# EAGLE schematic B684X (EAGLE 6.6.0)
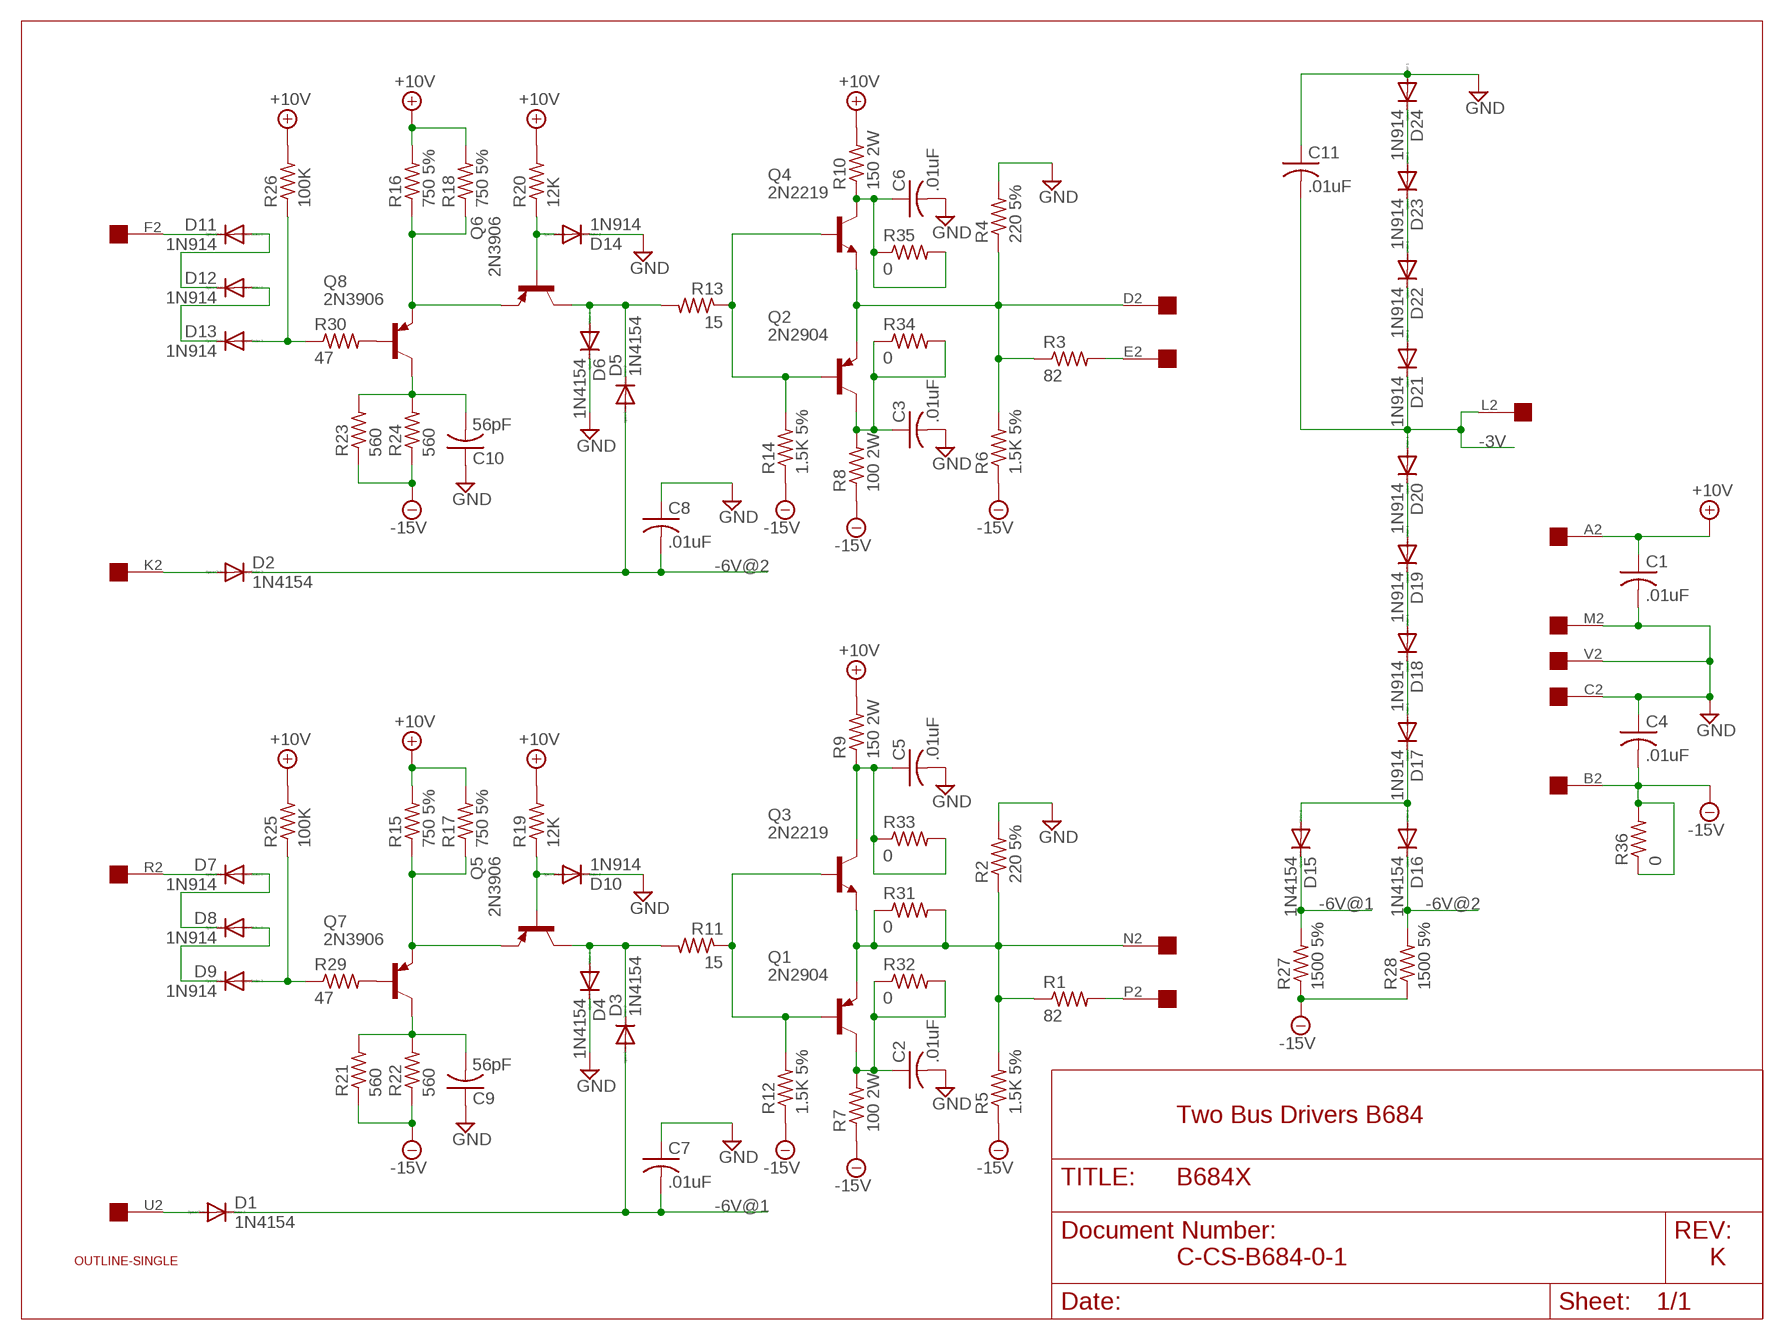
[diagram p0: schematic, sheet 1]

## Parts
C1  .01uF  C-US  [C063-025X075]
C2  .01uF  C-US  [C063-025X075]
C3  .01uF  C-US  [C063-025X075]
C4  .01uF  C-US  [C063-025X075]
C5  .01uF  C-US  [C063-025X075]
C6  .01uF  C-US  [C063-025X075]
C7  .01uF  C-US  [C063-025X075]
C8  .01uF  C-US  [C063-025X075]
C9  56pF  C-US  [C063-025X075]
C10  56pF  C-US  [C063-025X075]
C11  .01uF  C-US  [C063-025X075]
D1  1N4154  1N4148DO35-10  [DO35-10]
D2  1N4154  1N4148DO35-10  [DO35-10]
D3  1N4154  1N4148DO35-10  [DO35-10]
D4  1N4154  1N4148DO35-10  [DO35-10]
D5  1N4154  1N4148DO35-10  [DO35-10]
D6  1N4154  1N4148DO35-10  [DO35-10]
D7  1N914  1N4148DO35-10  [DO35-10]
D8  1N914  1N4148DO35-10  [DO35-10]
D9  1N914  DIODE-DO35-10  [DO35-10]
D10  1N914  1N4148DO35-10  [DO35-10]
D11  1N914  1N4148DO35-10  [DO35-10]
D12  1N914  1N4148DO35-10  [DO35-10]
D13  1N914  DIODE-DO35-10  [DO35-10]
D14  1N914  1N4148DO35-10  [DO35-10]
D15  1N4154  1N4148DO35-10  [DO35-10]
D16  1N4154  1N4148DO35-10  [DO35-10]
D17  1N914  1N4148DO35-10  [DO35-10]
D18  1N914  1N4148DO35-10  [DO35-10]
D19  1N914  1N4148DO35-10  [DO35-10]
D20  1N914  1N4148DO35-10  [DO35-10]
D21  1N914  1N4148DO35-10  [DO35-10]
D22  1N914  1N4148DO35-10  [DO35-10]
D23  1N914  1N4148DO35-10  [DO35-10]
D24  1N914  1N4148DO35-10  [DO35-10]
Q1  2N2904  2N3637  [TO39]
Q2  2N2904  2N3637  [TO39]
Q3  2N2219  [TO5]
Q4  2N2219  [TO5]
Q5  2N3906  2N3637  [TO39]
Q6  2N3906  2N3637  [TO39]
Q7  2N3906  2N3637  [TO39]
Q8  2N3906  2N3637  [TO39]
R1  82  R-US_0207/10  [0207/10]
R2  220 5%  R-US_0207/10  [0207/10]
R3  82  R-US_0207/10  [0207/10]
R4  220 5%  R-US_0207/10  [0207/10]
R5  1.5K 5%  R-US_0207/10  [0207/10]
R6  1.5K 5%  R-US_0207/10  [0207/10]
R7  100 2W  R-US_0817/22  [P0817/22]
R8  100 2W  R-US_0817/22  [P0817/22]
R9  150 2W  R-US_0817/22  [P0817/22]
R10  150 2W  R-US_0817/22  [P0817/22]
R11  15  R-US_0207/10  [0207/10]
R12  1.5K 5%  R-US_0207/10  [0207/10]
R13  15  R-US_0207/10  [0207/10]
R14  1.5K 5%  R-US_0207/10  [0207/10]
R15  750 5%  R-US_0207/10  [0207/10]
R16  750 5%  R-US_0207/10  [0207/10]
R17  750 5%  R-US_0207/10  [0207/10]
R18  750 5%  R-US_0207/10  [0207/10]
R19  12K  R-US_0207/10  [0207/10]
R20  12K  R-US_0207/10  [0207/10]
R21  560  R-US_0207/10  [0207/10]
R22  560  R-US_0207/10  [0207/10]
R23  560  R-US_0207/10  [0207/10]
R24  560  R-US_0207/10  [0207/10]
R25  100K  R-US_0207/10  [0207/10]
R26  100K  R-US_0207/10  [0207/10]
R27  1500 5%  R-US_0207/10  [0207/10]
R28  1500 5%  R-US_0207/10  [0207/10]
R29  47  R-US_0207/10  [0207/10]
R30  47  R-US_0207/10  [0207/10]
R31  0  R-US_0207/10  [0207/10]
R32  0  R-US_0207/10  [0207/10]
R33  0  R-US_0207/10  [0207/10]
R34  0  R-US_0207/10  [0207/10]
R35  0  R-US_0207/10  [0207/10]
R36  0  R-US_0207/10  [0207/10]
U$1  OUTLINE-SINGLE  [SINGLE]
U$2  EDGE-1  [EDGE-CON1]

## Nets
+10V [Power]: C1.1 R9.2 R10.2 R15.2 R16.2 R17.2 R18.2 R19.2 R20.2 R25.2 R26.2 U$2.A2
-3V [Power]: C11.2 D20.A D21.C U$2.L2
-6V@1: C7.2 D1.C D3.A D15.C R27.2
-6V@2: C8.2 D2.C D5.A D16.C R28.2
-15V [Power]: C4.2 R5.1 R6.1 R7.1 R8.1 R12.1 R14.1 R21.1 R22.1 R23.1 R24.1 R27.1 R28.1 R36.1 R36.2 U$2.B2
GND [Power]: C1.2 C2.2 C3.2 C4.1 C5.2 C6.2 C7.1 C8.1 C9.1 C10.1 C11.1 D4.C D6.C D10.C D14.C D24.A R2.2 R4.2 U$2.C2 U$2.M2 U$2.V2
N$1: D11.C U$2.F2
N$2: D11.A D12.C
N$3: D13.A R26.1 R30.1
N$4: D12.A D13.C
N$5: Q7.2(B) R29.2
N$6: C10.2 Q8.3(C) R23.2 R24.2
N$7: Q6.1(E) Q8.1(E) R16.1 R18.1
N$8: D14.A Q6.2(B) R20.1
N$9: Q2.1(E) Q4.1(E) R3.1 R4.1 R6.2 U$2.D2
N$10: C6.1 Q4.3(C) R10.1 R35.1 R35.2
N$11: C3.1 Q2.3(C) R8.2 R34.1 R34.2
N$12: D18.A D19.C
N$13: D22.A D23.C
N$14: D5.C D6.A Q6.3(C) R13.2
N$15: Q2.2(B) Q4.2(B) R13.1 R14.2
N$16: D21.A D22.C
N$17: D2.A U$2.K2
N$18: R3.2 U$2.E2
N$19: D7.C U$2.R2
N$20: D17.A D18.C
N$21: D7.A D8.C
N$22: D8.A D9.C
N$23: D9.A R25.1 R29.1
N$24: D19.A D20.C
N$25: Q8.2(B) R30.2
N$26: C9.2 Q7.3(C) R21.2 R22.2
N$27: Q5.1(E) Q7.1(E) R15.1 R17.1
N$28: D10.A Q5.2(B) R19.1
N$29: D3.C D4.A Q5.3(C) R11.2
N$30: Q1.2(B) Q3.2(B) R11.1 R12.2
N$31: D1.A U$2.U2
N$32: D15.A D16.A D17.C
N$33: Q1.1(E) Q3.1(E) R1.1 R2.1 R5.2 R31.1 R31.2 U$2.N2
N$35: C2.1 Q1.3(C) R7.2 R32.1 R32.2
N$36: R1.2 U$2.P2
N$37: D23.A D24.C
N$38: C5.1 Q3.3(C) R9.1 R33.1 R33.2
Unconnected: U$2.H2 U$2.J2 U$2.S2 U$2.T2

## Notes on the sheet
- Two Bus Drivers B684
- C-CS-B684-0-1 | K

## Library data of the parts
C1-C11 = dec-con:C-US: Capacitors with funky DEC lead spacing.
D1-D8 D10-D12 D14-D24 = diode:1N4148: DIODE high speed (Philips)
D9 D13 = diode:DIODE-: DIODE
Q1 Q2 Q5-Q8 = transistor-pnp:2N3637*: PNP Transistror
Q3 Q4 = transistor:2N2219: NPN TRANSISTOR
R1-R36 = rcl:R-US_: RESISTOR, American symbol
U$1 = dec-con:OUTLINE-*: Board outlines for DEC boards.
U$2 = dec-con:EDGE-1: Single-Sided DEC Edge Connector -- (side 2)

## Net classes
1 Power: width 0.813 mm